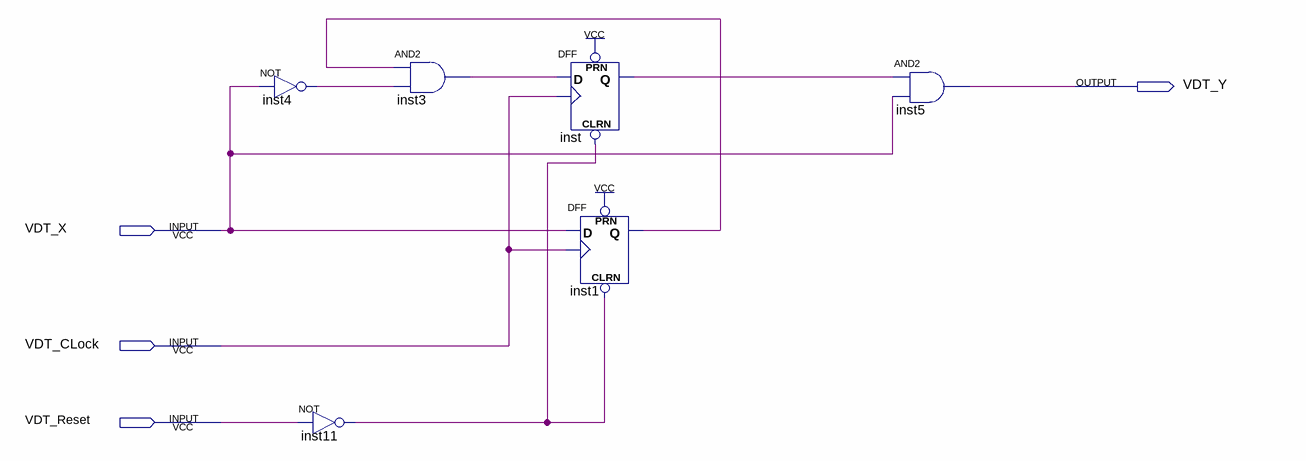
[diagram p0: schematic sheet]
// Quartus schematic assignment2.bdf as structural Verilog: 6 symbols, 4 pins
module assignment2 (
  input  VDT_X,
  input  VDT_CLock,
  input  VDT_Reset,
  output VDT_Y
);

  wire inst1_q, inst3_out, inst4_out, inst11_out, inst_q;

  not inst4 (inst4_out, VDT_X);
  not inst11 (inst11_out, VDT_Reset);
  and inst3 (inst3_out, inst1_q, inst4_out);
  DFF inst (.CLRN(inst11_out), .CLK(VDT_CLock), .D(inst3_out), .PRN(1'b1), .Q(inst_q));
  DFF inst1 (.CLRN(inst11_out), .CLK(VDT_CLock), .D(VDT_X), .PRN(1'b1), .Q(inst1_q));
  and inst5 (VDT_Y, inst_q, VDT_X);
endmodule
